# Altium schematic sheet power.SchDoc
size A4; SheetNumber: 1; SheetTotal: 3
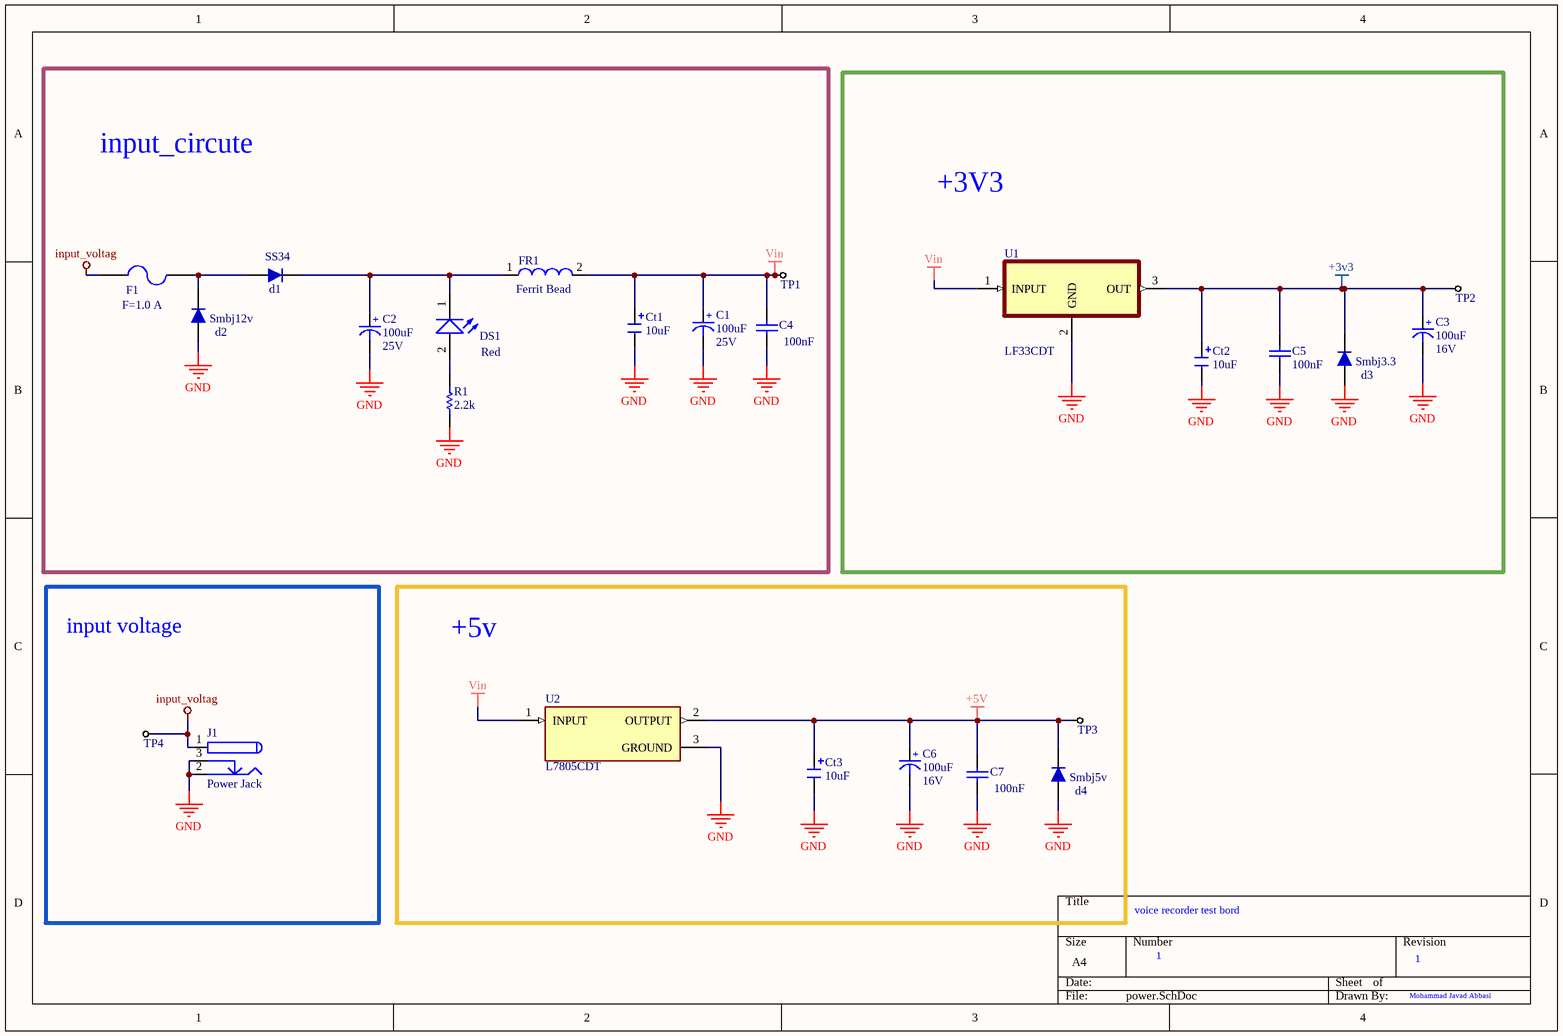
[diagram p0: power.SchDoc]

## Parts
C1  Voltage: 25V  [cap 03]  (hidden comment: 100uF)
C2  Voltage: 25V  [cap 03]  (hidden comment: 100uF)
C3  Voltage: 16V  [cap 03]  (hidden comment: 100uF)
C4  value 100nF  [CAP805]
C5  value 100nF  [CAP805]
C6  Voltage: 16V  [cap 03]  (hidden comment: 100uF)
C7  value 100nF  [CAP805]
Ct1  10uF  [Tantalium Size B]
Ct2  10uF  [Tantalium Size B]
Ct3  10uF  [Tantalium Size B]
d1  SS34  [DIODE SMA (DO-214AC)]
d2  Smbj12v  [DIODE SMA (DO-214AC)]
d3  Smbj3.3  [DIODE SMA (DO-214AC)]
d4  Smbj5v  [DIODE SMA (DO-214AC)]
DS1  Red  [LED 1206]
F1  F=1.0 A  [1206 FUSE]
FR1  Ferrit Bead  [RES1206]
J1  Power Jack  [Power Jack]
R1  2.2k  [RES0805]
TP1  (no value)  [TP10]
TP2  (no value)  [TP10]
TP3  (no value)  [TP10]
TP4  (no value)  [TP10]
U1  LF33CDT  [TO228P972X240-3N]
U2  L7805CDT  [VREG_L7805CDT]

## Blocks framed on the sheet
input_circute: C1 C2 C4 Ct1 d1 d2 DS1 F1 FR1 R1 TP1
+3V3: C3 C5 Ct2 d3 TP2 U1
input voltage: J1 TP4
+5v: C6 C7 Ct3 d4 TP3 U2

## Nets
+3v3: C3.1(+) C5.2 Ct2.1 d3.2 TP2.1(TP) U1.3(OUT)
+5V: C6.1(+) C7.2 Ct3.1 d4.2 TP3.1(TP) U2.2(OUTPUT)
GND: C1.2(-) C2.2(-) C3.2(-) C4.1 C5.1 C6.2(-) C7.1 Ct1.2 Ct2.2 Ct3.2 d2.1 d3.1 d4.1 J1.2 J1.3 R1.1 U1.2(GND) U2.3(GROUND)
input_voltag: F1.1 J1.1 TP4.1(TP)
Vin: C1.1(+) C4.2 Ct1.1 FR1.2 TP1.1(TP) U1.1(INPUT) U2.1(INPUT)
NetC2_1: C2.1(+) d1.2 DS1.1(K) FR1.1
Netd1_1: d1.1 d2.2 F1.2
NetDS1_2: DS1.2(A) R1.2

## Notes on the sheet
- voice recorder test bord
- 1
- Mohammad Javad Abbasi

## Library data of the parts
C1-C3 C6 = CAP_Polar: Polar Capacitor; Designer: Eng. Saeid Jorablo; Company: SJ Libraries; ComponentLink1Description: Datasheet; ComponentLink2Description: Reference; Publisher: SJ Unlimited; Mounting Technology: Surface Mount\Through-Hole; HelpURL: http://s3.picofile.com/file/7443264187/Coming_Soon_logo.gif; Status: Unreleased; Value: 100uF
C4 C5 C7 = Cap: Capacitor; Published: 8-Jun-2000; LatestRevisionDate: 17-Jul-2002; LatestRevisionNote: Re-released for DXP Platform.; Publisher: Altium Limited
Ct1-Ct3 = Capacitor Tantalium: Tantalium Cap 10uF .... 100uF; Value: 10uF
d1 = 1n4007 SMD M7: soutkey diod; Part. No: M7; Manufacturer: DC COMPONENTS; Designer: Abbas Basereh; Link: http://www.tme.eu/en/details/m7/smd-universal-diodes/dc-components/; Link: https://www.aliexpress.com/item/Smd-tube-1n4007-m7-SMA/1213719741.html?spm=2114.01010208.3.1.ZyZ7bC&ws_ab_test=searchweb0_0,searchweb201602_4_10065_10068_10084_10083_10080_10082_10081_10060_10061_10062_10056_10055_10054_10059_10099_10078_10079_427_10073_10103_10102_10096_10052_10050_10051,searchweb201603_4&btsid=db2be5ca-e560-400a-b91c-484ab5ee228b; Data: 16-12-2016
d2-d4 = 1n4007 SMD M7: Smbj5.0; Part. No: M7; Manufacturer: DC COMPONENTS; Designer: Abbas Basereh; Link: http://www.tme.eu/en/details/m7/smd-universal-diodes/dc-components/; Link: https://www.aliexpress.com/item/Smd-tube-1n4007-m7-SMA/1213719741.html?spm=2114.01010208.3.1.ZyZ7bC&ws_ab_test=searchweb0_0,searchweb201602_4_10065_10068_10084_10083_10080_10082_10081_10060_10061_10062_10056_10055_10054_10059_10099_10078_10079_427_10073_10103_10102_10096_10052_10050_10051,searchweb201603_4&btsid=db2be5ca-e560-400a-b91c-484ab5ee228b; Data: 16-12-2016
DS1 = LED SMD PACKAGE: SMD Mono-color Chip LED Waterclear; Part Number: 150080BS75000; Peak Wavelength: 465 nm; Forward Voltage: 3.2 V; Published Date: Jan 2017; Publisher: Ali Hafizi
F1 = Fuse SMD1206: SMD Fuses 1206; Designer: Abbas Basereh; Desc.: SMD Fuses 1206; Data: 16-12-2016
J1 = Power Jack: Designer: Saeid Jorablo; Company: Personal; Project Name: Laser; Adding Date: 10/21/2009
R1 = RES 0805 0.125W_1: RES 0805; Designer: Abbas Basereh; Desc.: RES SMD 0805; Data: 16-12-2016
TP1-TP4 = Test Point: Company: SJ Libraries; Designer: Eng. Saeid Jorablo; Mounting Technology: Surface Mount\Through-Hole; ComponentLink1Description: Datasheet; Pin Count: 0; Update Date: 6/3/2012; Category: MISC; HelpURL: http://s3.picofile.com/file/7443264187/Coming_Soon_logo.gif
U1 = LF33CDT: LDO, 0.45VDO, 1A, 3.3V, 1%, 3TO252; MF: {'manufacturer': u'STMicroelectronics'}; Package: None; Price: None; Value: *; MP: LF33CDT; Availability: Unavailable
U2 = L7805CDT: MF: {'manufacturer': u'STMicroelectronics'}; Package: None; Price: None; Value: *; MP: L7805CDT; Availability: Unavailable